# EAGLE schematic PGTNXEN_pitch_out (EAGLE 8.5.2)
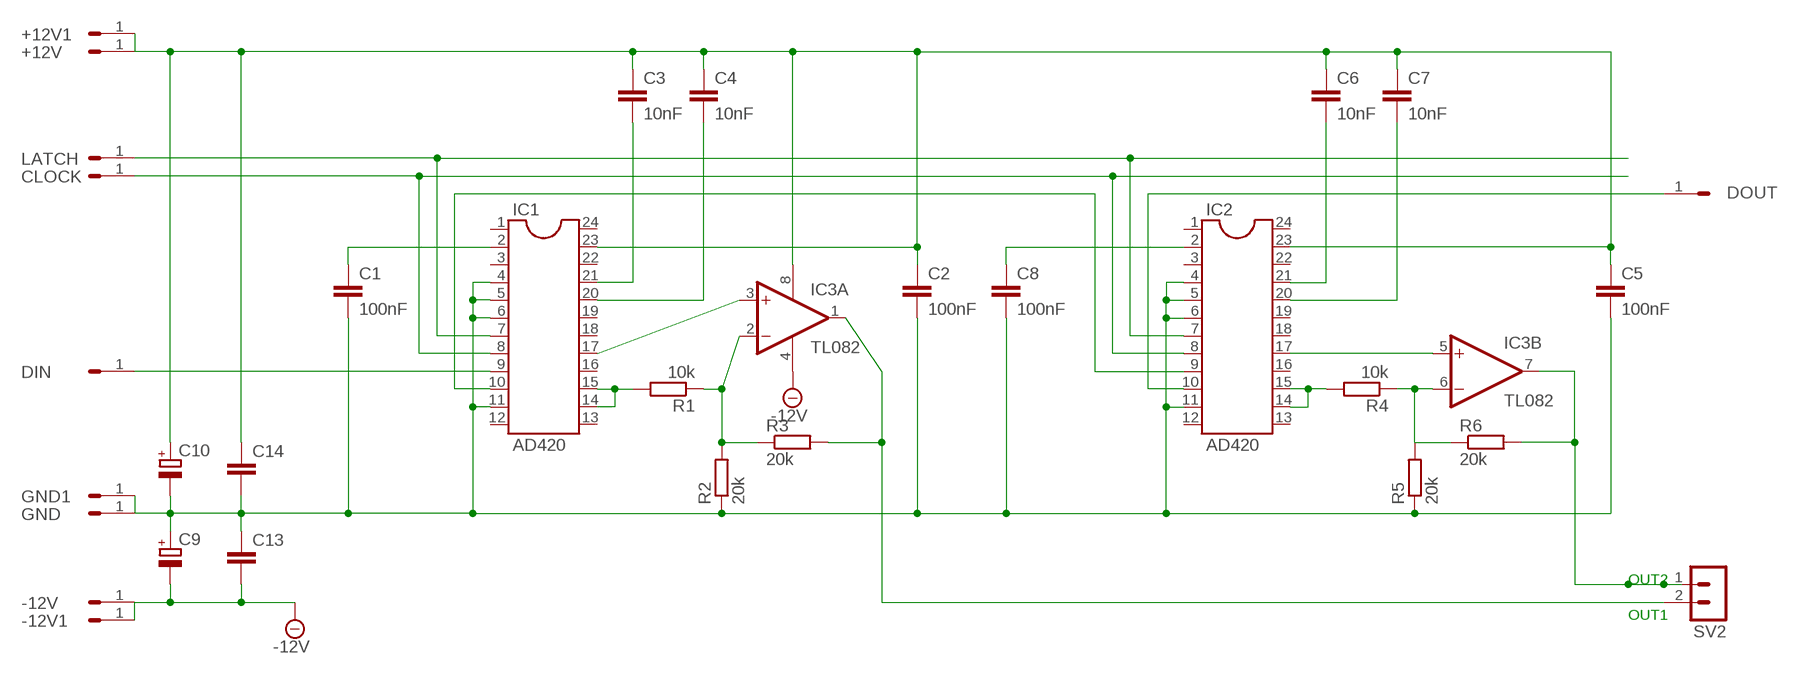
[diagram p0: schematic, sheet 1]

## Parts
+12V  HEADER/MALE/01  [HEADER/MALE/01]
+12V1  HEADER/MALE/01  [HEADER/MALE/01]
-12V  HEADER/MALE/01  [HEADER/MALE/01]
-12V1  HEADER/MALE/01  [HEADER/MALE/01]
C1  100nF  CAPACITORCERAMICDISC/5  [CERAMICDISC/5]
C2  100nF  CAPACITORCERAMICDISC/5  [CERAMICDISC/5]
C3  10nF  CAPACITORCERAMICDISC/5  [CERAMICDISC/5]
C4  10nF  CAPACITORCERAMICDISC/5  [CERAMICDISC/5]
C5  100nF  CAPACITORCERAMICDISC/5  [CERAMICDISC/5]
C6  10nF  CAPACITORCERAMICDISC/5  [CERAMICDISC/5]
C7  10nF  CAPACITORCERAMICDISC/5  [CERAMICDISC/5]
C8  100nF  CAPACITORCERAMICDISC/5  [CERAMICDISC/5]
C9  CAPACITOR/POLARIZEDE2.5-6  [E2,5-6]
C10  CAPACITOR/POLARIZEDE2.5-6  [E2,5-6]
C13  CAPACITORCERAMICDISC/5  [CERAMICDISC/5]
C14  CAPACITORCERAMICDISC/5  [CERAMICDISC/5]
CLOCK  HEADER/MALE/01  [HEADER/MALE/01]
DIN  HEADER/MALE/01  [HEADER/MALE/01]
DOUT  HEADER/MALE/01  [HEADER/MALE/01]
GND  HEADER/MALE/01  [HEADER/MALE/01]
GND1  HEADER/MALE/01  [HEADER/MALE/01]
IC1  AD420  DIL24-3  [DIL24-3]
IC2  AD420  DIL24-3  [DIL24-3]
IC3  TL082  LM358N  [DIL08]
LATCH  HEADER/MALE/01  [HEADER/MALE/01]
R1  10k  R-EU_0204/7  [0204/7]
R2  20k  R-EU_0204/7  [0204/7]
R3  20k  RESISTORRESISTOR/UPRIGHT/7.5  [RESISTOR/7.5]
R4  10k  R-EU_0204/7  [0204/7]
R5  20k  R-EU_0204/7  [0204/7]
R6  20k  RESISTORRESISTOR/UPRIGHT/7.5  [RESISTOR/7.5]
SV2  HEADER/MALE/02-1  [HEADER/MALE/02-1]

## Nets
-12V: -12V1.1 -12V.1 C9.- C13.2 IC3.4(P:V-)
GND: C1.2 C2.2 C5.2 C8.2 C9.+ C10.- C13.1 C14.2 GND1.1 GND.1 IC1.4 IC1.5 IC1.6 IC1.11 IC2.4 IC2.5 IC2.6 IC2.11 R2.1 R5.1
N$1: IC1.7 IC2.7 LATCH.1
N$2: CLOCK.1 IC1.8 IC2.8
N$3: DIN.1 IC1.9
N$4: IC2.14 IC2.15 R4.2
N$5: DOUT.1 IC2.10
N$6: IC3.2(A:-IN) R1.1 R2.2 R3.1
N$7: +12V1.1 +12V.1 C2.1 C3.1 C4.1 C5.1 C6.1 C7.1 C10.+ C14.1 IC1.23 IC2.23 IC3.8(P:V+)
N$8: C1.1 IC1.2
N$9: C3.2 IC1.21
N$10: C4.2 IC1.20
N$11: IC1.17 IC3.3(A:+IN)
N$12: IC1.14 IC1.15 R1.2
N$13: IC3.1(A:OUT) R3.2 SV2.2
N$15: IC1.10 IC2.9
N$16: IC2.17 IC3.5(B:+IN)
N$17: IC3.7(B:OUT) R6.2 SV2.1
N$19: C8.1 IC2.2
N$20: C6.2 IC2.21
N$21: C7.2 IC2.20
N$22: IC3.6(B:-IN) R4.1 R5.2 R6.1
Unconnected: IC1.1 IC1.3 IC1.12 IC1.13 IC1.16 IC1.18 IC1.19 IC1.22 IC1.24 IC2.1 IC2.3 IC2.12 IC2.13 IC2.16 IC2.18 IC2.19 IC2.22 IC2.24

## Notes on the sheet
- OUT2
- OUT1

## Library data of the parts
+12V +12V1 -12V -12V1 CLOCK DIN DOUT GND GND1 LATCH = connectors:HEADER/MALE/01
C1-C8 C13 C14 = capacitors:CAPACITOR: CAPACITOR, European symbol
C9 C10 = capacitors:CAPACITOR/POLARIZED: POLARIZED CAPACITOR, European symbol
IC1 IC2 = ic-package:DIL24: Dual In Line
IC3 = linear:LM358: OP AMP also LM158; LM258; LM2904 Source: http://cache.national.com/ds/LM/LM158.pdf
R1 R2 R4 R5 = rcl:R-EU_: RESISTOR, European symbol
R3 R6 = resistors:RESISTOR: RESISTOR, European symbol
SV2 = connectors:HEADER/MALE/02-1: PIN HEADER